# Altium schematic sheet PHY_ETHERNET.SchDoc
size Tabloid; DrawnBy: Émile Laplante; Size: 11x17; Sheet_Name: Phy ethernet
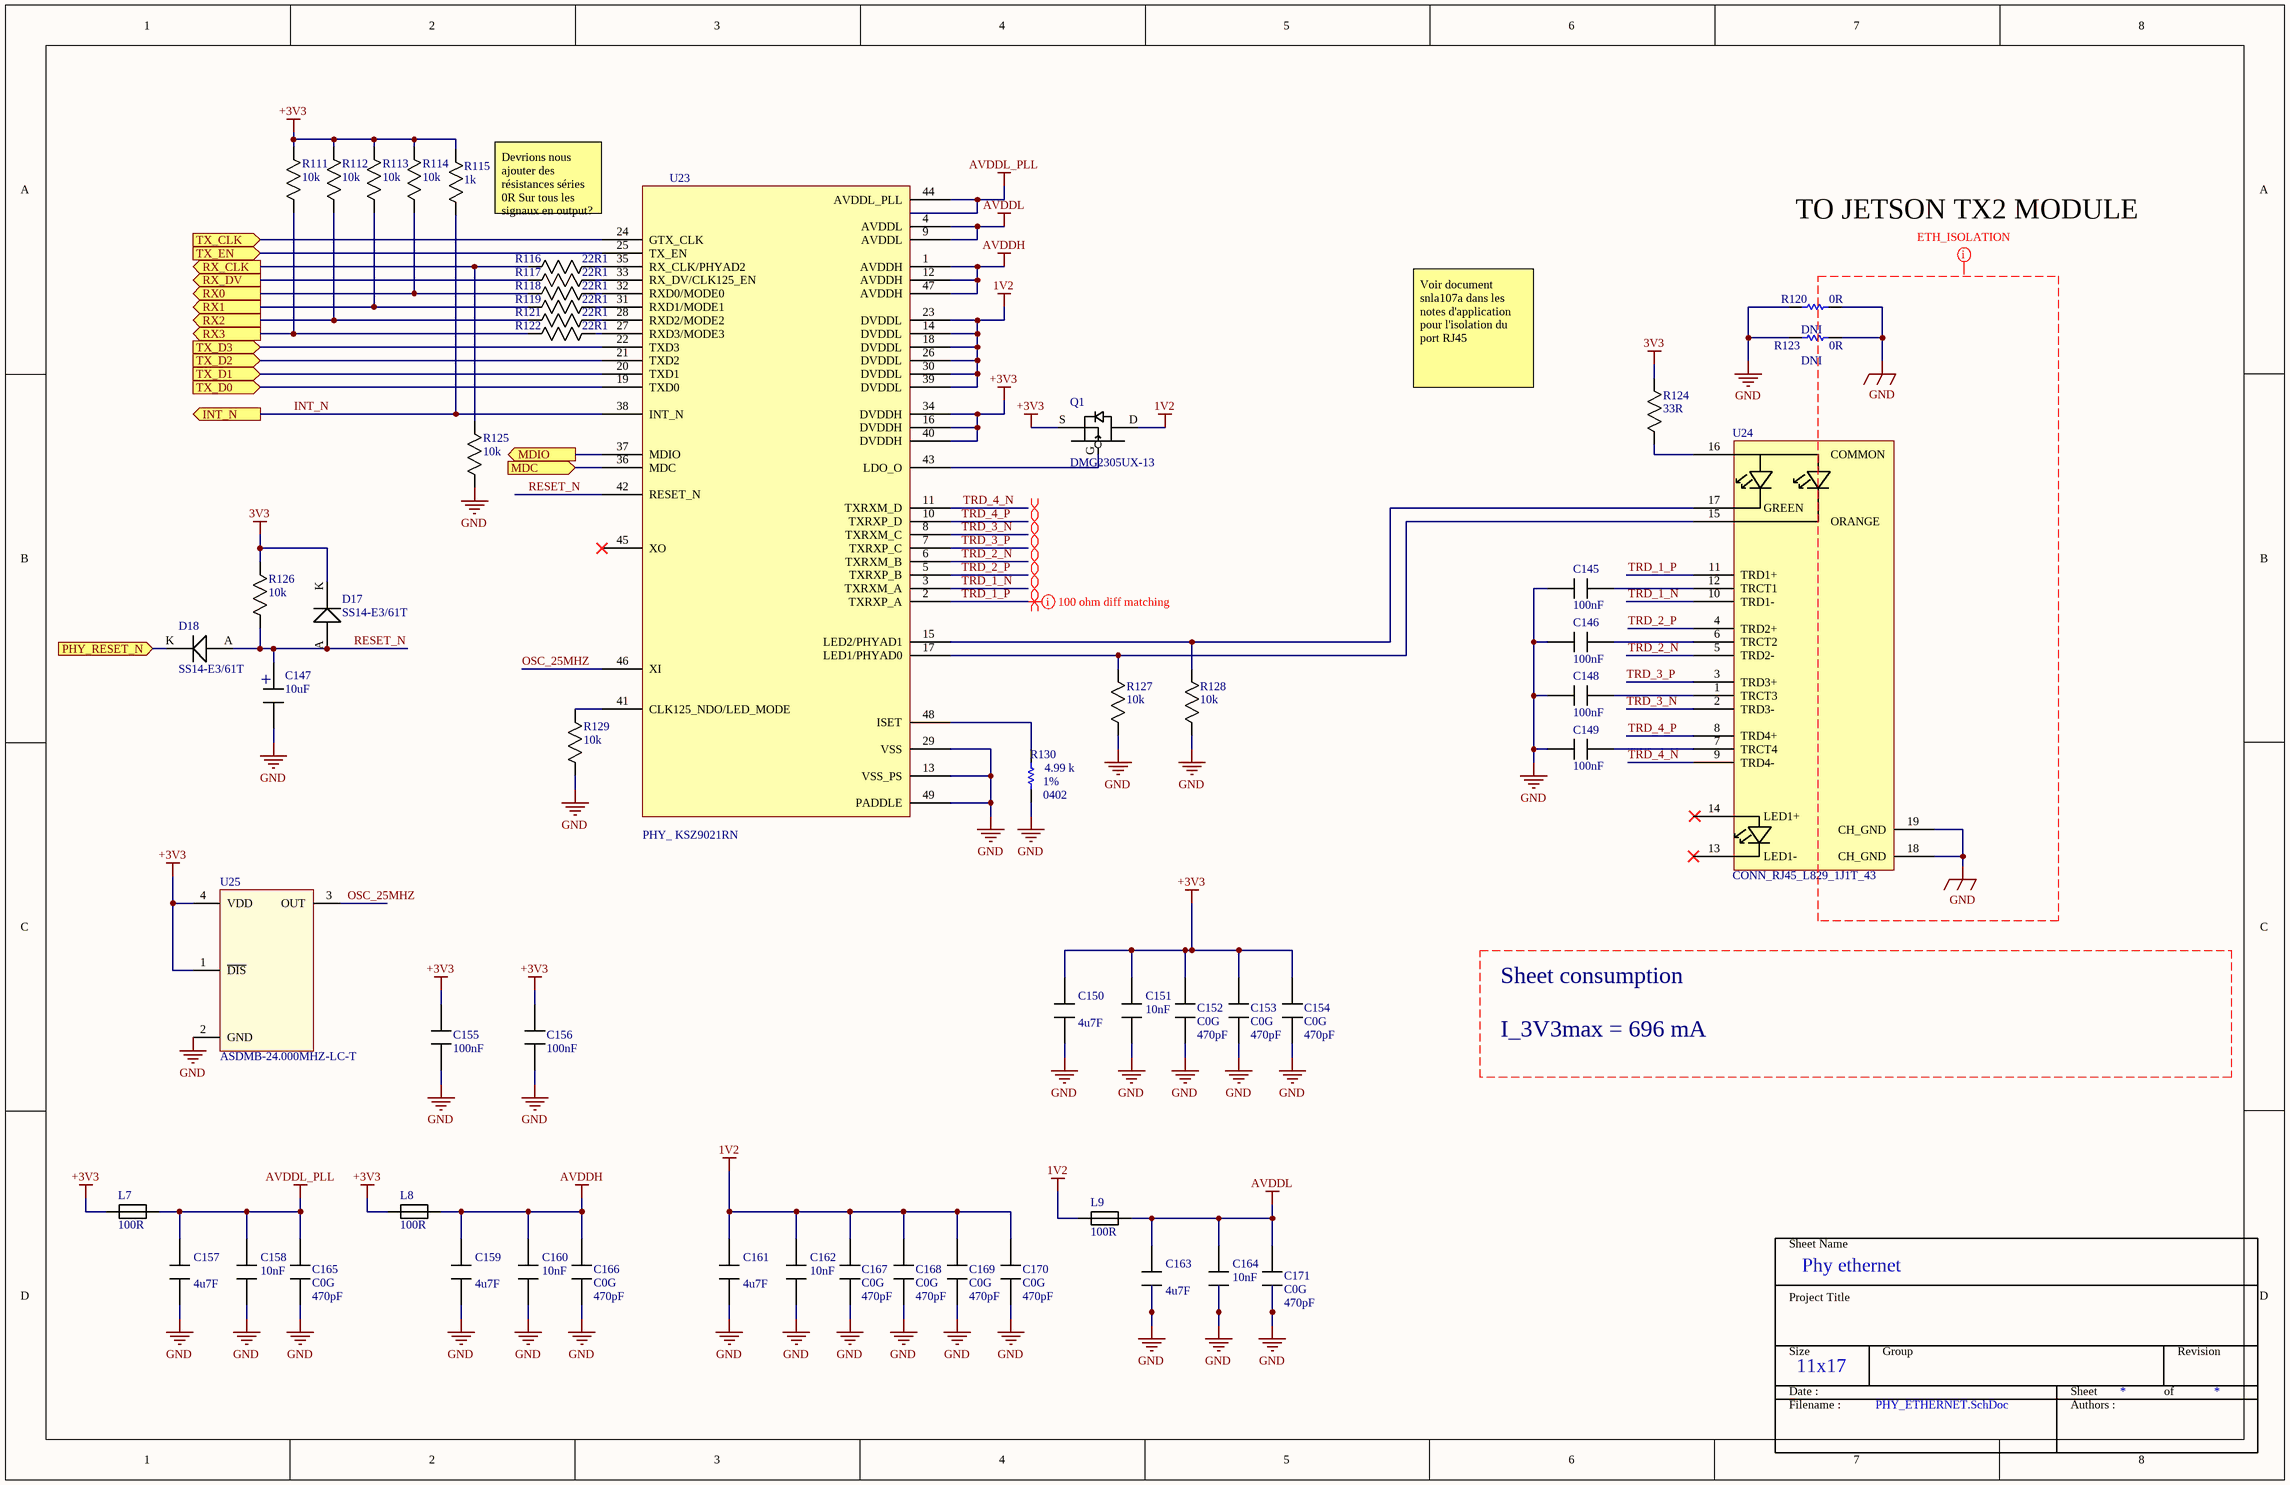
[diagram p0: PHY_ETHERNET.SchDoc]

## Parts
C145  value 100nF  [0603]  (hidden comment: Capacitor)
C146  value 100nF  [0603]  (hidden comment: Capacitor)
C147  value 10uF  [CAP_RAD_SMD_DIA157]  (hidden comment: Capacitor_Polarized)
C148  value 100nF  [0603]  (hidden comment: Capacitor)
C149  value 100nF  [0603]  (hidden comment: Capacitor)
C150  value 4u7F  [0805]  (hidden comment: Capacitor)
C151  value 10nF  [0603]  (hidden comment: Capacitor)
C152  value 470pF  Type: C0G  [0603]  (hidden comment: Capacitor)
C153  value 470pF  Type: C0G  [0603]  (hidden comment: Capacitor)
C154  value 470pF  Type: C0G  [0603]  (hidden comment: Capacitor)
C155  value 100nF  [0603]  (hidden comment: Capacitor)
C156  value 100nF  [0603]  (hidden comment: Capacitor)
C157  value 4u7F  [0805]  (hidden comment: Capacitor)
C158  value 10nF  [0603]  (hidden comment: Capacitor)
C159  value 4u7F  [0805]  (hidden comment: Capacitor)
C160  value 10nF  [0603]  (hidden comment: Capacitor)
C161  value 4u7F  [0805]  (hidden comment: Capacitor)
C162  value 10nF  [0603]  (hidden comment: Capacitor)
C163  value 4u7F  [0805]  (hidden comment: Capacitor)
C164  value 10nF  [0603]  (hidden comment: Capacitor)
C165  value 470pF  Type: C0G  [0603]  (hidden comment: Capacitor)
C166  value 470pF  Type: C0G  [0603]  (hidden comment: Capacitor)
C167  value 470pF  Type: C0G  [0603]  (hidden comment: Capacitor)
C168  value 470pF  Type: C0G  [0603]  (hidden comment: Capacitor)
C169  value 470pF  Type: C0G  [0603]  (hidden comment: Capacitor)
C170  value 470pF  Type: C0G  [0603]  (hidden comment: Capacitor)
C171  value 470pF  Type: C0G  [0603]  (hidden comment: Capacitor)
D17  Mfg_PN: SS14-E3/61T  [DIODE_SMA]  (hidden comment: Diode)
D18  Mfg_PN: SS14-E3/61T  [DIODE_SMA]  (hidden comment: Diode)
L7  value 100R  [0603]  (hidden comment: Ferrite)
L8  value 100R  [0603]  (hidden comment: Ferrite)
L9  value 100R  [0603]  (hidden comment: Ferrite)
Q1  Mfg_PN: DMG2305UX-13  [SOT23_GDS]  (hidden comment: MOSFET_P_GDS)
R111  value 10k  [0603]  (hidden comment: Resistor)
R112  value 10k  [0603]  (hidden comment: Resistor)
R113  value 10k  [0603]  (hidden comment: Resistor)
R114  value 10k  [0603]  (hidden comment: Resistor)
R115  value 1k  [0603]  (hidden comment: Resistor)
R116  value 22R1  [0402]  (hidden comment: Resistor)
R117  value 22R1  [0402]  (hidden comment: Resistor)
R118  value 22R1  [0402]  (hidden comment: Resistor)
R119  value 22R1  [0402]  (hidden comment: Resistor)
R120  value 0R  Specification: DNI  [RES_1206]  (hidden comment: RES - 1206)
R121  value 22R1  [0402]  (hidden comment: Resistor)
R122  value 22R1  [0402]  (hidden comment: Resistor)
R123  value 0R  Specification: DNI  [RES_1206]  (hidden comment: RES - 1206)
R124  value 33R  [0603]  (hidden comment: Resistor)
R125  value 10k  [0603]  (hidden comment: Resistor)
R126  value 10k  [0603]  (hidden comment: Resistor)
R127  value 10k  [0603]  (hidden comment: Resistor)
R128  value 10k  [0603]  (hidden comment: Resistor)
R129  value 10k  [0603]  (hidden comment: Resistor)
R130  value 4.99 k  Package: 0402  Precision: 1%  [RES_0402]  (hidden comment: RES - 0402)
U23  PHY_ KSZ9021RN  [PHY_KSZ9021RN]
U24  CONN_RJ45_L829_1J1T_43  [L829-1J1T-43]
U25  Mfg_PN: ASDMB-24.000MHZ-LC-T  [OSC_ADSMB]  (hidden comment: OSC_ASDMB)

## Ports
INT_N (out), MDC (in), MDIO (out), PHY_RESET_N (in), RX0 (out), RX1 (out), RX2 (out), RX3 (out), RX_CLK (out), RX_DV (out), TX_CLK (in), TX_D0 (in), TX_D1 (in), TX_D2 (in), TX_D3 (in), TX_EN (in)

## Nets
1V2: C161.1 C162.1 C167.2 C168.2 C169.2 C170.2 L9.1 Q1.D U23.14(DVDDL) U23.18(DVDDL) U23.23(DVDDL) U23.26(DVDDL) U23.30(DVDDL) U23.39(DVDDL)
3V3: D17.K R124.2 R126.2
+3V3: C150.1 C151.1 C152.2 C153.2 C154.2 C155.1 C156.1 L7.1 L8.1 Q1.S R111.1 R112.1 R113.1 R114.1 R115.2 U23.16(DVDDH) U23.34(DVDDH) U23.40(DVDDH) U25.1(~{DIS}) U25.4(VDD)
AVDDH: C159.1 C160.1 C166.2 L8.2 U23.1(AVDDH) U23.12(AVDDH) U23.47(AVDDH)
AVDDL: C163.1 C164.1 C171.2 L9.2 U23.4(AVDDL) U23.9(AVDDL)
AVDDL_PLL: C157.1 C158.1 C165.2 L7.2 U23.44(AVDDL_PLL)
GND: C145.2 C146.2 C147.- C148.2 C149.2 C150.2 C151.2 C152.1 C153.1 C154.1 C155.2 C156.2 C157.2 C158.2 C159.2 C160.2 C161.2 C162.2 C163.2 C164.2 C165.1 C166.1 C167.1 C168.1 C169.1 C170.1 C171.1 R120.1 R120.2 R123.1 R123.2 R125.2 R127.2 R128.2 R129.2 R130.1 U23.13(VSS_PS) U23.29(VSS) U23.49(PADDLE) U24.18(CH_GND) U24.19(CH_GND) U25.2(GND)
INT_N: R115.1 U23.38(INT_N) ; port INT_N
MDC: U23.36(MDC) ; port MDC
MDIO: U23.37(MDIO) ; port MDIO
OSC_25MHZ: U23.46(XI) U25.3(OUT)
PHY_RESET_N: D18.K ; port PHY_RESET_N
RESET_N: C147.+ D17.A D18.A R126.1 U23.42(RESET_N)
RX0: R114.2 R118.1 ; port RX0
RX1: R113.2 R119.1 ; port RX1
RX2: R112.2 R121.1 ; port RX2
RX3: R111.2 R122.1 ; port RX3
RX_CLK: R116.1 R125.1 ; port RX_CLK
RX_DV: R117.1 ; port RX_DV
TRD_1_N: U23.3(TXRXM_A) U24.10(TRD1-)
TRD_1_P: U23.2(TXRXP_A) U24.11(TRD1+)
TRD_2_N: U23.6(TXRXM_B) U24.5(TRD2-)
TRD_2_P: U23.5(TXRXP_B) U24.4(TRD2+)
TRD_3_N: U23.8(TXRXM_C) U24.2(TRD3-)
TRD_3_P: U23.7(TXRXP_C) U24.3(TRD3+)
TRD_4_N: U23.11(TXRXM_D) U24.9(TRD4-)
TRD_4_P: U23.10(TXRXP_D) U24.8(TRD4+)
TX_CLK: U23.24(GTX_CLK) ; port TX_CLK
TX_D0: U23.19(TXD0) ; port TX_D0
TX_D1: U23.20(TXD1) ; port TX_D1
TX_D2: U23.21(TXD2) ; port TX_D2
TX_D3: U23.22(TXD3) ; port TX_D3
TX_EN: U23.25(TX_EN) ; port TX_EN
NetC145_1: C145.1 U24.12(TRCT1)
NetC146_1: C146.1 U24.6(TRCT2)
NetC148_1: C148.1 U24.1(TRCT3)
NetC149_1: C149.1 U24.7(TRCT4)
NetQ1_G: Q1.G U23.43(LDO_O)
NetR116_2: R116.2 U23.35(RX_CLK/PHYAD2)
NetR117_2: R117.2 U23.33(RX_DV/CLK125_EN)
NetR118_2: R118.2 U23.32(RXD0/MODE0)
NetR119_2: R119.2 U23.31(RXD1/MODE1)
NetR121_2: R121.2 U23.28(RXD2/MODE2)
NetR122_2: R122.2 U23.27(RXD3/MODE3)
NetR124_1: R124.1 U24.16(COMMON)
NetR127_1: R127.1 U23.17(LED1/PHYAD0) U24.15(ORANGE)
NetR128_1: R128.1 U23.15(LED2/PHYAD1) U24.17(GREEN)
NetR129_1: R129.1 U23.41(CLK125_NDO/LED_MODE)
NetR130_2: R130.2 U23.48(ISET)

Not connected (* = marked no-connect by the designer): U23 45(XO)*; U24 13(LED1-)* 14(LED1+)

## Layout directives
differential pair: TRD_1_N, TRD_1_P, TRD_2_N, TRD_2_P, TRD_3_N, TRD_3_P, TRD_4_N, TRD_4_P
net class TO JETSON TX2 MODULE: GND
rule Undefined: TRD_1_P

## Notes on the sheet
- Devrions nous ajouter des résistances séries 0R Sur tous les signaux en output?
- Voir document snla107a dans les notes d'application pour l'isolation du port RJ45
- Sheet consumption
- I_3V3max = 696 mA
- Sheet Name
- Project Title
- Size
- Group
- Revision
- Date :
- Filename :
- Sheet
- Authors :
- of

## Library data of the parts
C145 C146 C148 C149 C155 C156 = Capacitor: Mfg: Samsung; Mfg_PN: CL10F104ZO8NNNC; HelpURL: *; Supplier1: Digikey; Supplier1_PN: 1276-1258-1-ND; Tolerance: *; Type: *; Rating: *
  C145 C146 C148 C149: NI: NI
  C155 C156: NI: *
C147 = Capacitor_Polarized: Capacitor; Mfg: Nichicon; Mfg_PN: UWX1C100MCL1GB; HelpURL: *; NI: *; Supplier1: Digikey; Supplier1_PN: 493-2100-1-ND; Tolerance: *; Type: *; Rating: *
C150 C157 C159 C161 C163 = Capacitor: Mfg: Samsung; Mfg_PN: CL21A475KAQNNNG; HelpURL: *; NI: *; Supplier1: Digikey; Supplier1_PN: 1276-6462-1-ND; Tolerance: *; Type: *; Rating: *
C151 C158 C160 C162 C164 = Capacitor: Mfg: Murata; Mfg_PN: CL05B103KO5NNNC; HelpURL: *; NI: *; Supplier1: Digikey; Supplier1_PN: 1276-1051-1-ND; Tolerance: *; Type: *; Rating: *
C152-C154 C165-C171 = Capacitor: Mfg: Samsung; Mfg_PN: CL10C471JB8NCNC; HelpURL: *; NI: *; Supplier1: Digikey; Supplier1_PN: 1276-2302-1-ND; Tolerance: *; Rating: *
D17 D18 = Diode: Mfg: Vishay; HelpURL: *; NI: *; Supplier1: Digikey; Supplier1_PN: SS14-E3/61TGICT-ND; Tolerance: *; Type: *; Rating: *; Value: *
L7-L9 = Ferrite: Mfg: Bourns; Mfg_PN: MH2029-101Y; Rating: 1A; HelpURL: *; NI: *; Supplier1: Digikey; Supplier1_PN: MH2029-101YCT-ND; Tolerance: *; Type: *
Q1 = MOSFET_P_GDS: PMOS; Mfg: Diodes Incorporated; HelpURL: *; NI: *; Rating: *; Supplier1: Digikey; Supplier1_PN: DMG2305UX-13DICT-ND; Tolerance: *; Type: *; Value: *
R111-R114 R125-R129 = Resistor: Mfg: Yageo; Mfg_PN: RC0603JR-0710KL; HelpURL: *; NI: *; Supplier1: Digikey; Supplier1_PN: 311-10KGRCT-ND; Type: *; Rating: *; Tolerance: *
R115 = Resistor: Mfg: Yageo; Mfg_PN: RC0603JR-071KL; HelpURL: *; NI: *; Supplier1: Digikey; Supplier1_PN: 311-1.0KGRCT-ND; Type: *; Rating: *; Tolerance: *
R116-R119 R121 R122 = Resistor: Mfg: Yageo; Mfg_PN: RC0402FR-0722R1L; HelpURL: *; NI: *; Supplier1: Digikey; Supplier1_PN: 311-22.1LRCT-ND; Type: *; Rating: *; Tolerance: *
R120 R123 = RES - 1206: Mfg Part Number: RMCF1206ZT0R00; Mfg: Stackpole Electronics Inc; Precision: 1%; Current: *; HelpURL: https://www.digikey.ca/product-detail/en/stackpole-electronics-inc/RMCF1206ZT0R00/RMCF1206ZT0R00TR-ND/1756906; CreatedBy: Jonathan Bouchard; Package: 1206
R124 = Resistor: Mfg: Yageo; Mfg_PN: RC0603JR-0733RL; HelpURL: *; NI: *; Supplier1: Digikey; Supplier1_PN: 311-33GRCT-ND; Type: *; Rating: *; Tolerance: *
R130 = RES - 0402: Mfg Part Number: RC0402FR-074K99L; Suplier Part Number: 311-4.99KLRCT-ND; Mfg: Yageo; Power: 1/16W; Current: *; HelpURL: https://www.digikey.ca/product-detail/en/yageo/RC0402FR-074K99L/311-4.99KLRCT-ND/2827886; CreatedBy: Jonathan Bouchard; Supplier: Digikey
U23 = PHY_ KSZ9021RN: Mfg: Microchip Technology; CreatedBy: Emile Laplante; HelpURL: https://www.digikey.ca/product-detail/en/microchip-technology/KSZ9021RN/576-3637-ND/2184487; Mfg Part Number: KSZ9021RN; NI: *; Package: 48-VFQFN Exposed Pad; Power: *; Supplier: Digikey; Supplier Part Numer: 576-3637-ND; Temperature: *; Value: *; VerifiedBy: *; Voltage: *
U24 = CONN_RJ45_L829_1J1T_43: Mfg: Bel Fuse Inc.; CreatedBy: Emile Laplante; HelpURL: https://www.digikey.ca/products/en?keywords=L829-1J1T-43; Mfg Part Number: L829-1J1T-43; NI: *; Package: RJ45; Power: *; Supplier: Digikey; Supplier Part Numer: 380-1110-ND; Temperature: *; Value: *; VerifiedBy: *; Voltage: *
U25 = OSC_ASDMB: Oscillator; 1V8 to 3V3; Mfg: Abracon; HelpURL: http://www.abracon.com/Oscillators/ASDMB.pdf; Supplier1: Digikey; Supplier1_PN: 535-11728-1-ND; NI: *; Type: 24MHz